# EAGLE schematic FDNverbV1_1 (EAGLE 7.6.0)
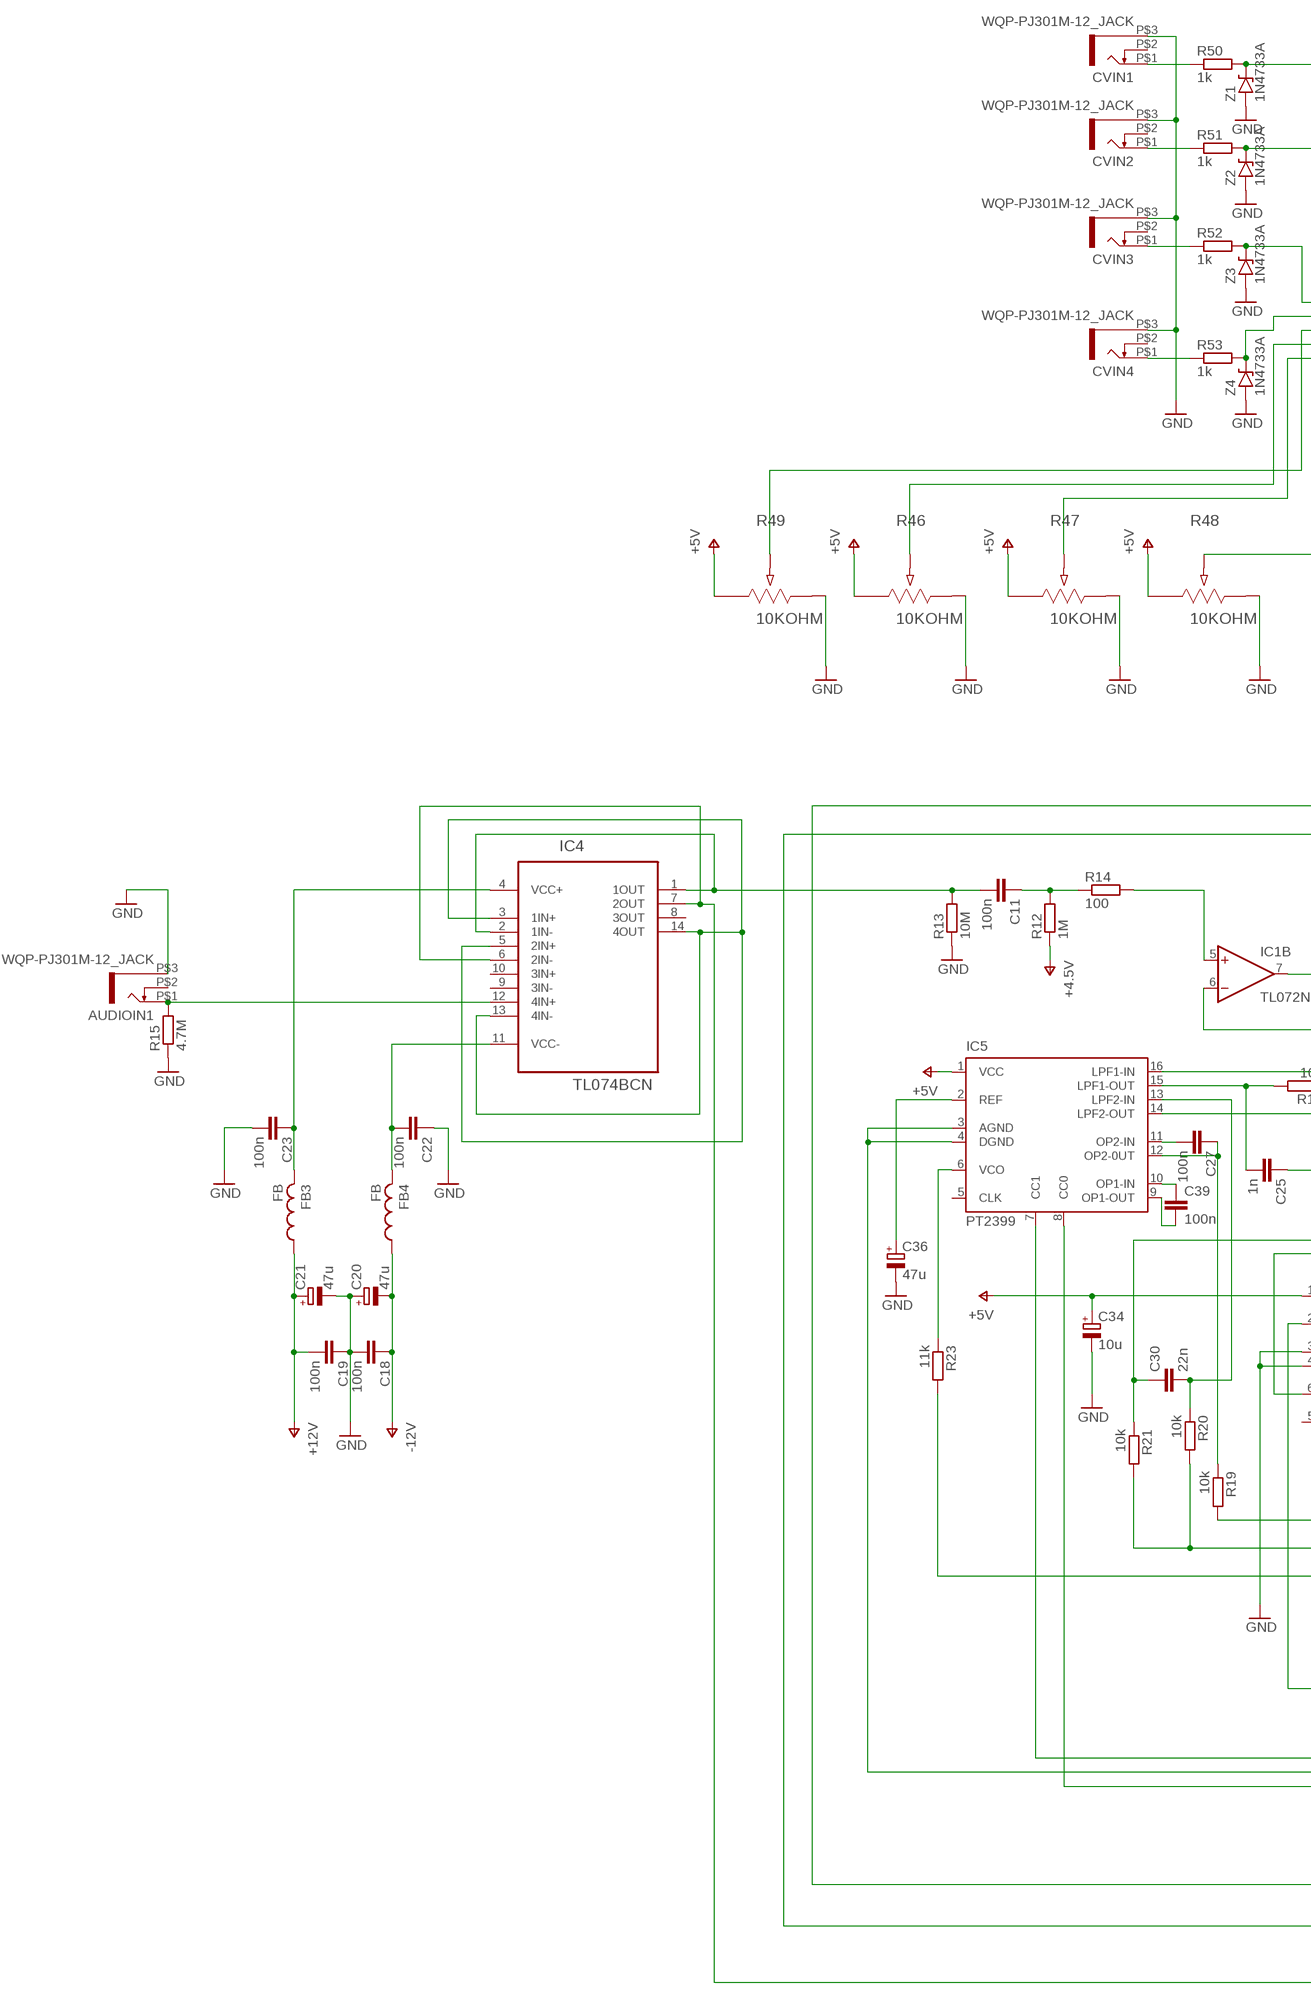
[diagram p0: schematic, sheet 1, part 1 of 3]
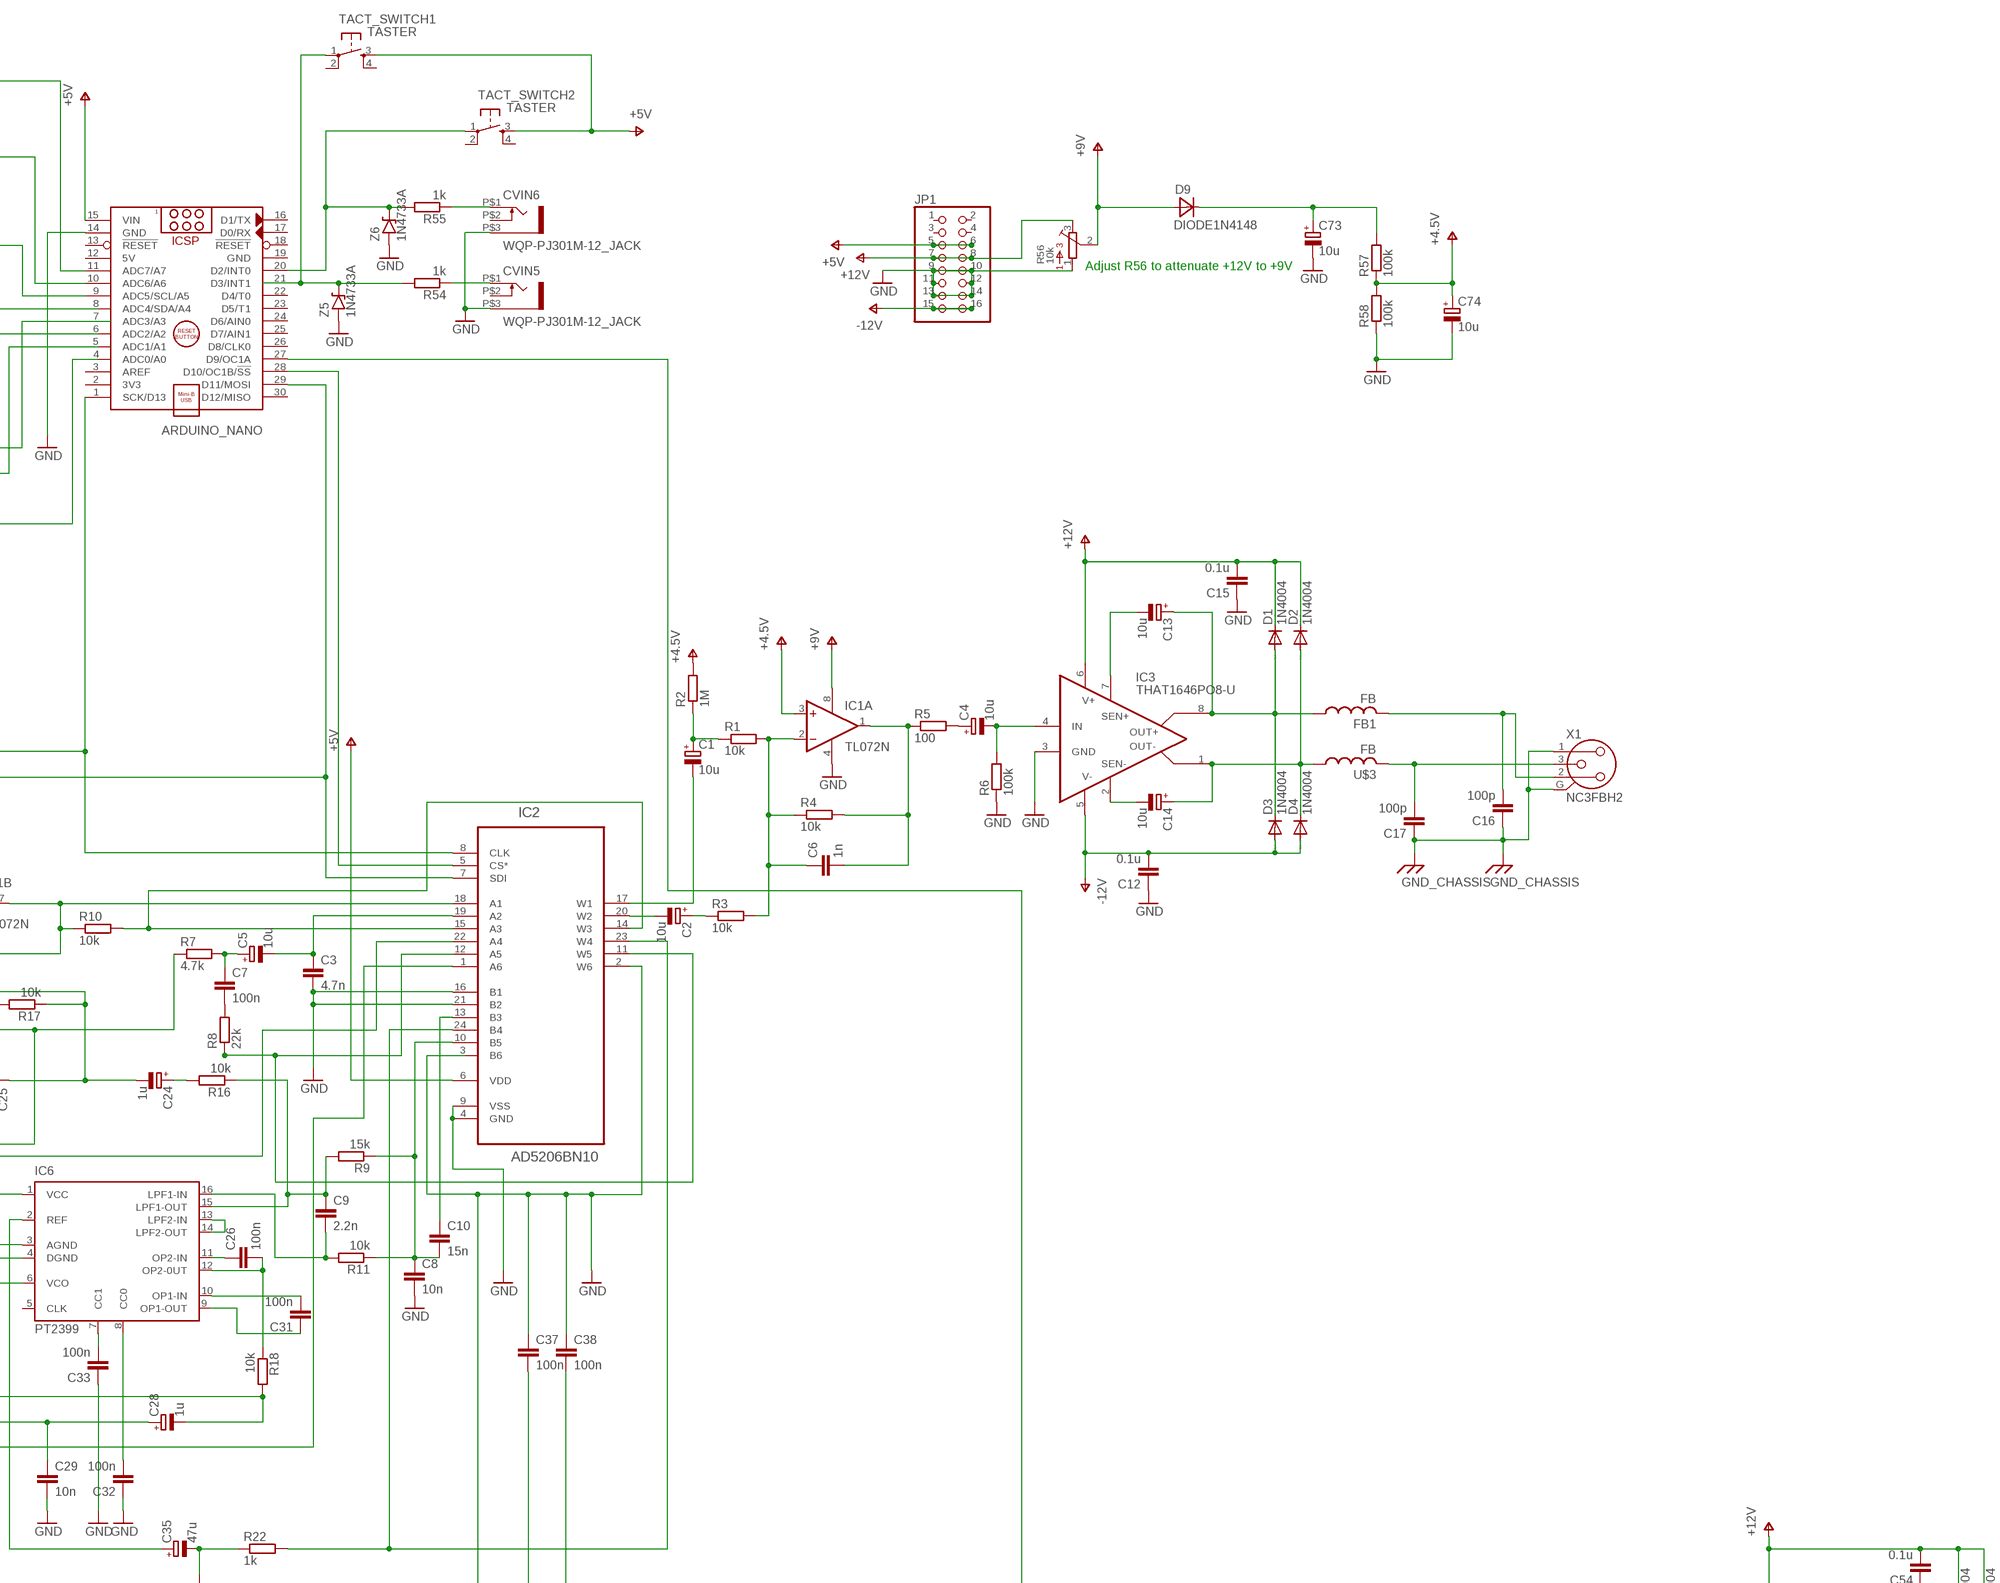
[diagram p1: schematic, sheet 1, part 2 of 3]
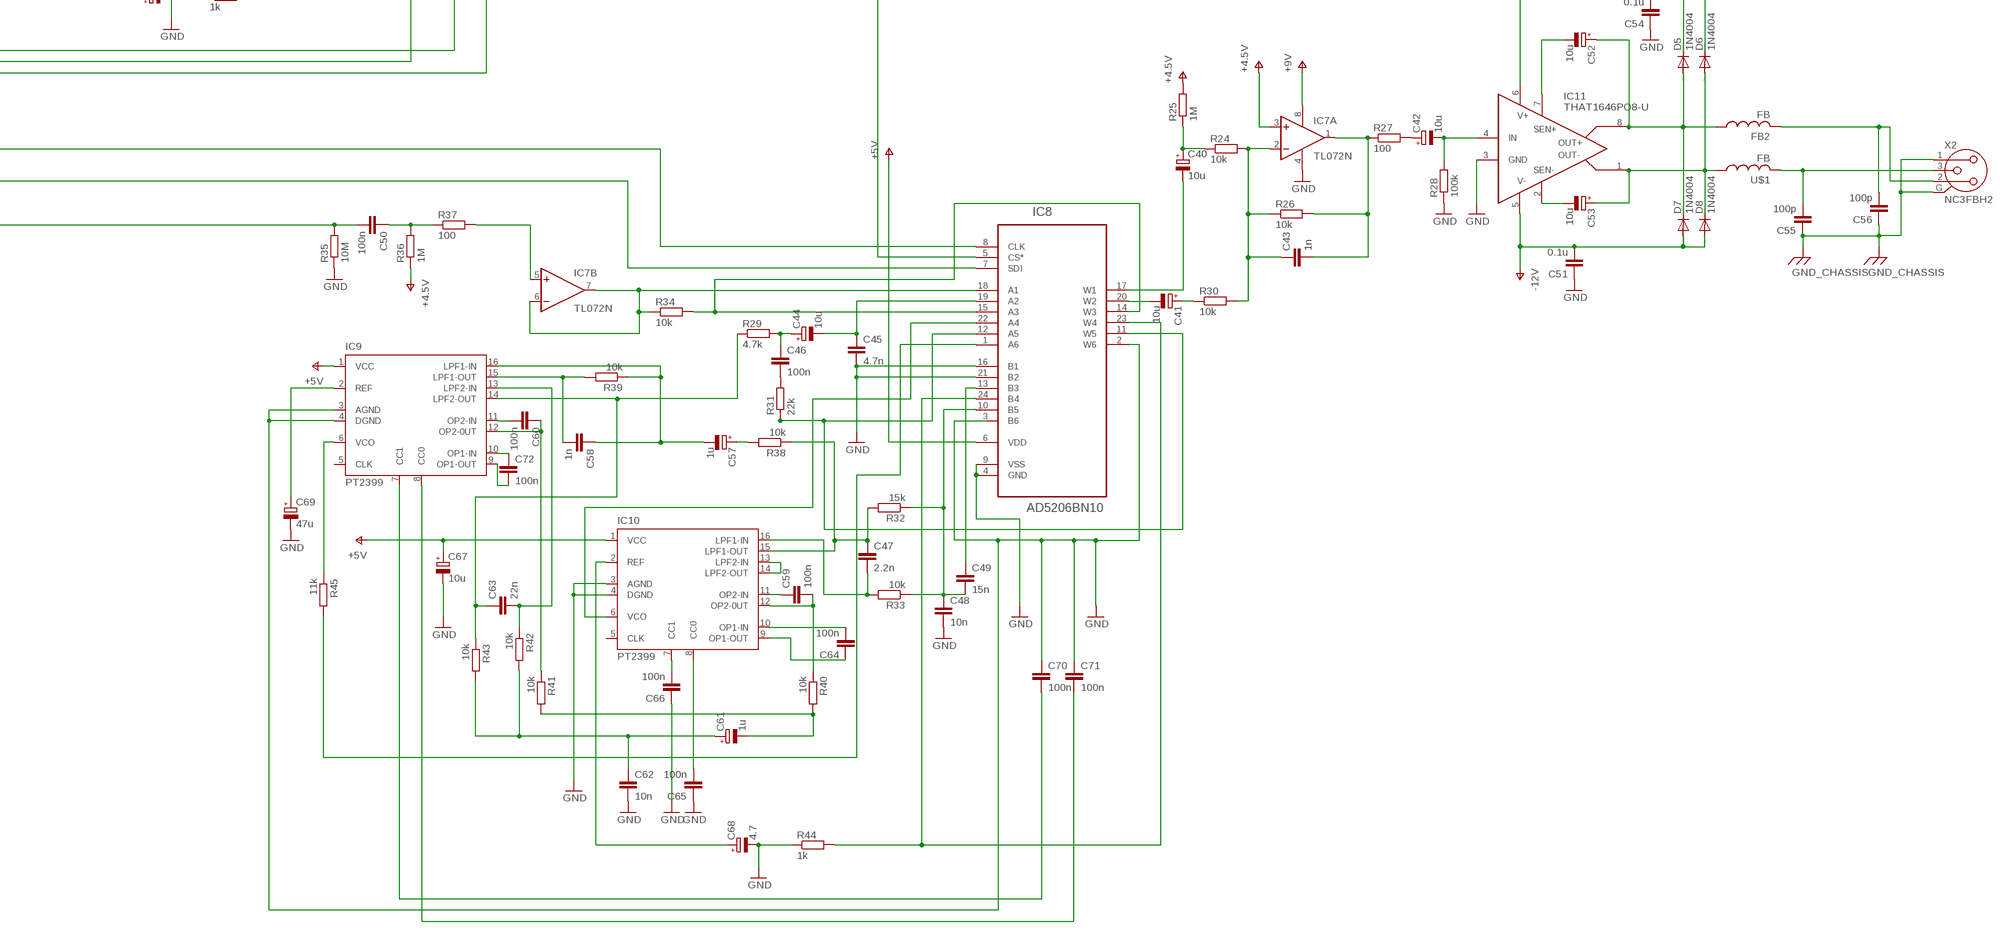
[diagram p2: schematic, sheet 1, part 3 of 3]

## Parts
ARDUINO_NANO  ARDUINO_NANO  [ARDUINO_NANO]
AUDIOIN1  WQP-PJ301M-12_JACK  [WQP-PJ301M-12_JACK]
C1  10u  CPOL3  [E5-5]
C2  10u  CPOL3  [E5-5]
C3  4.7n  C-EUC1206  [C1206]
C4  10u  CPOL3  [E5-5]
C5  10u  CPOL3  [E5-5]
C6  1n  C-EUC1206  [C1206]
C7  100n  C-EUC1206  [C1206]
C8  10n  C-EUC1206  [C1206]
C9  2.2n  C-EUC1206  [C1206]
C10  15n  C-EUC1206  [C1206]
C11  100n  C-EUC1206  [C1206]
C12  0.1u  C-EUC1206  [C1206]
C13  10u  CPOL3  [E5-5]
C14  10u  CPOL3  [E5-5]
C15  0.1u  C-EUC1206  [C1206]
C16  100p  C-EUC1206  [C1206]
C17  100p  C-EUC1206  [C1206]
C18  100n  C-EUC1206  [C1206]
C19  100n  C-EUC1206  [C1206]
C20  47u  CPOL3  [E5-5]
C21  47u  CPOL3  [E5-5]
C22  100n  C-EUC1206  [C1206]
C23  100n  C-EUC1206  [C1206]
C24  1u  CPOL3  [E5-5]
C25  1n  C-EUC1206  [C1206]
C26  100n  C-EUC1206  [C1206]
C27  100n  C-EUC1206  [C1206]
C28  1u  CPOL3  [E5-5]
C29  10n  C-EUC1206  [C1206]
C30  22n  C-EUC1206  [C1206]
C31  100n  C-EUC1206  [C1206]
C32  100n  C-EUC1206  [C1206]
C33  100n  C-EUC1206  [C1206]
C34  10u  CPOL3  [E5-5]
C35  47u  CPOL3  [E5-5]
C36  47u  CPOL3  [E5-5]
C37  100n  C-EUC1206  [C1206]
C38  100n  C-EUC1206  [C1206]
C39  100n  C-EUC1206  [C1206]
C40  10u  CPOL3  [E5-5]
C41  10u  CPOL3  [E5-5]
C42  10u  CPOL3  [E5-5]
C43  1n  C-EUC1206  [C1206]
C44  10u  CPOL3  [E5-5]
C45  4.7n  C-EUC1206  [C1206]
C46  100n  C-EUC1206  [C1206]
C47  2.2n  C-EUC1206  [C1206]
C48  10n  C-EUC1206  [C1206]
C49  15n  C-EUC1206  [C1206]
C50  100n  C-EUC1206  [C1206]
C51  0.1u  C-EUC1206  [C1206]
C52  10u  CPOL3  [E5-5]
C53  10u  CPOL3  [E5-5]
C54  0.1u  C-EUC1206  [C1206]
C55  100p  C-EUC1206  [C1206]
C56  100p  C-EUC1206  [C1206]
C57  1u  CPOL3  [E5-5]
C58  1n  C-EUC1206  [C1206]
C59  100n  C-EUC1206  [C1206]
C60  100n  C-EUC1206  [C1206]
C61  1u  CPOL3  [E5-5]
C62  10n  C-EUC1206  [C1206]
C63  22n  C-EUC1206  [C1206]
C64  100n  C-EUC1206  [C1206]
C65  100n  C-EUC1206  [C1206]
C66  100n  C-EUC1206  [C1206]
C67  10u  CPOL3  [E5-5]
C68  4.7  CPOL3  [E5-5]
C69  47u  CPOL3  [E5-5]
C70  100n  C-EUC1206  [C1206]
C71  100n  C-EUC1206  [C1206]
C72  100n  C-EUC1206  [C1206]
C73  10u  CPOL3  [E5-5]
C74  10u  CPOL3  [E5-5]
CVIN1  WQP-PJ301M-12_JACK  [WQP-PJ301M-12_JACK]
CVIN2  WQP-PJ301M-12_JACK  [WQP-PJ301M-12_JACK]
CVIN3  WQP-PJ301M-12_JACK  [WQP-PJ301M-12_JACK]
CVIN4  WQP-PJ301M-12_JACK  [WQP-PJ301M-12_JACK]
CVIN5  WQP-PJ301M-12_JACK  [WQP-PJ301M-12_JACK]
CVIN6  WQP-PJ301M-12_JACK  [WQP-PJ301M-12_JACK]
D1  1N4004  [DO41-10]
D2  1N4004  [DO41-10]
D3  1N4004  [DO41-10]
D4  1N4004  [DO41-10]
D5  1N4004  [DO41-10]
D6  1N4004  [DO41-10]
D7  1N4004  [DO41-10]
D8  1N4004  [DO41-10]
D9  DIODE1N4148  [DO-35]
FB1  FB  [FB]
FB2  FB  [FB]
FB3  FB  [FB]
FB4  FB  [FB]
IC1  TL072N  [DIL8]
IC2  AD5206BN10  [DIP254P762X508-24P]
IC3  THAT1646PO8-U  [DIL08]
IC4  TL074BCN  [DIP254P762X508-14]
IC5  PT2399  [DIP16]
IC6  PT2399  [DIP16]
IC7  TL072N  [DIL8]
IC8  AD5206BN10  [DIP254P762X508-24P]
IC9  PT2399  [DIP16]
IC10  PT2399  [DIP16]
IC11  THAT1646PO8-U  [DIL08]
JP1  PINHD-2X8-BIG  [2X8]
R1  10k  R-EU_M1206  [M1206]
R2  1M  R-EU_M1206  [M1206]
R3  10k  R-EU_M1206  [M1206]
R4  10k  R-EU_M1206  [M1206]
R5  100  R-EU_M1206  [M1206]
R6  100k  R-EU_M1206  [M1206]
R7  4.7k  R-EU_M1206  [M1206]
R8  22k  R-EU_M1206  [M1206]
R9  15k  R-EU_M1206  [M1206]
R10  10k  R-EU_M1206  [M1206]
R11  10k  R-EU_M1206  [M1206]
R12  1M  R-EU_M1206  [M1206]
R13  10M  R-EU_M1206  [M1206]
R14  100  R-EU_M1206  [M1206]
R15  4.7M  R-EU_M1206  [M1206]
R16  10k  R-EU_M1206  [M1206]
R17  10k  R-EU_M1206  [M1206]
R18  10k  R-EU_M1206  [M1206]
R19  10k  R-EU_M1206  [M1206]
R20  10k  R-EU_M1206  [M1206]
R21  10k  R-EU_M1206  [M1206]
R22  1k  R-EU_M1206  [M1206]
R23  11k  R-EU_M1206  [M1206]
R24  10k  R-EU_M1206  [M1206]
R25  1M  R-EU_M1206  [M1206]
R26  10k  R-EU_M1206  [M1206]
R27  100  R-EU_M1206  [M1206]
R28  100k  R-EU_M1206  [M1206]
R29  4.7k  R-EU_M1206  [M1206]
R30  10k  R-EU_M1206  [M1206]
R31  22k  R-EU_M1206  [M1206]
R32  15k  R-EU_M1206  [M1206]
R33  10k  R-EU_M1206  [M1206]
R34  10k  R-EU_M1206  [M1206]
R35  10M  R-EU_M1206  [M1206]
R36  1M  R-EU_M1206  [M1206]
R37  100  R-EU_M1206  [M1206]
R38  10k  R-EU_M1206  [M1206]
R39  10k  R-EU_M1206  [M1206]
R40  10k  R-EU_M1206  [M1206]
R41  10k  R-EU_M1206  [M1206]
R42  10k  R-EU_M1206  [M1206]
R43  10k  R-EU_M1206  [M1206]
R44  1k  R-EU_M1206  [M1206]
R45  11k  R-EU_M1206  [M1206]
R46  10KOHM  EVUF2LFL3B14-F2L_F3L  [POT-EVUF2L]
R47  10KOHM  EVUF2LFL3B14-F2L_F3L  [POT-EVUF2L]
R48  10KOHM  EVUF2LFL3B14-F2L_F3L  [POT-EVUF2L]
R49  10KOHM  EVUF2LFL3B14-F2L_F3L  [POT-EVUF2L]
R50  1k  R-EU_M1206  [M1206]
R51  1k  R-EU_M1206  [M1206]
R52  1k  R-EU_M1206  [M1206]
R53  1k  R-EU_M1206  [M1206]
R54  1k  R-EU_M1206  [M1206]
R55  1k  R-EU_M1206  [M1206]
R56  10k  3362H  [3362H]
R57  100k  R-EU_M1206  [M1206]
R58  100k  R-EU_M1206  [M1206]
TACT_SWITCH1  TASTER  [TASTER]
TACT_SWITCH2  TASTER  [TASTER]
U$1  FB  [FB]
U$3  FB  [FB]
X1  NC3FBH2  [NC3FBH2]
X2  NC3FBH2  [NC3FBH2]
Z1  1N4733A  1N47XX2  [DO41-2]
Z2  1N4733A  1N47XX2  [DO41-2]
Z3  1N4733A  1N47XX2  [DO41-2]
Z4  1N4733A  1N47XX2  [DO41-2]
Z5  1N4733A  1N47XX2  [DO41-2]
Z6  1N4733A  1N47XX2  [DO41-2]

## Nets
GND: ARDUINO_NANO.14(GND) AUDIOIN1.P$3 C3.2 C8.2 C12.1 C15.1 C16.1 C17.1 C18.2 C19.1 C20.+ C21.- C22.1 C23.2 C29.2 C32.1 C33.1 C34.- C35.- C36.- C37.1 C38.1 C45.2 C48.2 C51.1 C54.1 C55.1 C55.2 C56.1 C62.2 C65.1 C66.1 C67.- C68.- C69.- C70.1 C71.1 C73.- C74.- CVIN1.P$3 CVIN2.P$3 CVIN3.P$3 CVIN4.P$3 CVIN5.P$3 CVIN6.P$3 IC1.4(A:V-) IC2.2(W6) IC2.4(GND) IC2.9(VSS) IC2.16(B1) IC3.3(GND) IC5.3(AGND) IC5.4(DGND) IC6.3(AGND) IC6.4(DGND) IC7.4(A:V-) IC8.2(W6) IC8.4(GND) IC8.9(VSS) IC8.16(B1) IC8.21(B2) IC9.3(AGND) IC9.4(DGND) IC10.3(AGND) IC10.4(DGND) IC11.3(GND) JP1.9 JP1.10 JP1.11 JP1.12 JP1.13 JP1.14 R6.1 R13.1 R15.1 R22.1 R28.1 R35.1 R44.1 R46.3 R47.3 R48.3 R49.3 R56.1 R58.1 U$1.P$2 X1.1 X1.G X2.1 X2.G Z1.A Z2.A Z3.A Z4.A Z5.A Z6.A ; supply symbol labelled GND_CHASSIS
N$1: C6.1 IC1.2(A:-IN) R1.2 R3.2 R4.1
N$2: C1.+ R1.1 R2.1
N$3: C1.- IC2.17(W1)
N$4: IC1.6(B:-IN) IC1.7(B:OUT) IC2.18(A1) R10.1
N$5: C6.2 IC1.1(A:OUT) R4.2 R5.1
N$6: C4.+ R5.2
N$7: C2.- IC2.20(W2)
N$8: C2.+ R3.1
N$9: C4.- IC3.4(IN) R6.2
N$10: C3.1 C5.- IC2.19(A2)
N$11: C5.+ C7.1 R7.2
N$12: C31.2 IC6.10(OP1-IN)
N$13: R48.2
N$14: ARDUINO_NANO.1(SCK/D13) IC2.8(CLK) IC8.8(CLK)
N$15: ARDUINO_NANO.28(D10/OC1B/!SS) IC2.5(CS*)
N$16: IC2.11(W5) IC2.12(A5) R8.1
N$17: C7.2 R8.2
N$18: C9.1 IC6.15(LPF1-OUT) R9.2 R16.1
N$19: C8.1 C10.2 IC2.10(B5) R9.1 R11.1
N$20: C9.2 IC6.16(LPF1-IN) R11.2
N$21: IC2.14(W3) IC2.15(A3) R10.2
N$22: C10.1 IC2.13(B3)
N$23: C24.- C25.1 IC5.16(LPF1-IN) R17.1
N$24: C11.2 IC4.1(1OUT) IC4.2(1IN-) R13.2
N$25: C11.1 R12.2 R14.1
N$26: IC1.5(B:+IN) R14.2
N$27: C13.- IC3.7(SEN+)
N$28: C13.+ D1.A D3.C FB1.P$1 IC3.8(OUT+)
N$29: C14.- IC3.2(SEN-)
N$30: C14.+ D2.A D4.C IC3.1(OUT-) U$3.P$1
N$31: C17.2 U$3.P$2 X1.3
N$32: C16.2 FB1.P$2 X1.2
N$33: AUDIOIN1.P$1 IC4.12(4IN+) R15.2
N$34: IC4.3(1IN+) IC4.5(2IN+) IC4.13(4IN-) IC4.14(4OUT)
N$35: C22.2 FB4.P$2 IC4.11(VCC-)
N$36: C23.1 FB3.P$2 IC4.4(VCC+)
N$37: C50.2 IC4.6(2IN-) IC4.7(2OUT) R35.2
N$38: IC6.13(LPF2-IN) IC6.14(LPF2-OUT)
N$39: C24.+ R16.2
N$40: C25.2 IC5.15(LPF1-OUT) R17.2
N$41: C26.1 IC6.11(OP2-IN)
N$42: C26.2 IC6.12(OP2-0UT) R18.1
N$43: C28.- R18.2 R19.2
N$44: C27.1 IC5.12(OP2-0UT) R19.1
N$45: C27.2 IC5.11(OP2-IN)
N$46: C30.1 IC5.14(LPF2-OUT) R7.1 R21.1
N$47: C28.+ C29.1 R20.2 R21.2
N$48: C30.2 IC5.13(LPF2-IN) R20.1
N$49: C31.1 IC6.9(OP1-OUT)
N$50: C35.+ IC6.2(REF)
N$51: C32.2 IC6.8(CC0)
N$52: C33.2 IC6.7(CC1)
N$53: C37.2 IC5.7(CC1)
N$54: IC2.23(W4) IC2.24(B4) R22.2
N$55: IC2.22(A4) IC6.6(VCO)
N$56: C36.+ IC5.2(REF)
N$57: IC5.6(VCO) R23.1
N$58: IC2.1(A6) R23.2
N$59: C38.2 IC5.8(CC0)
N$60: C39.1 IC5.10(OP1-IN)
N$61: C39.2 IC5.9(OP1-OUT)
N$62: C43.1 IC7.2(A:-IN) R24.2 R26.1 R30.2
N$63: C40.+ R24.1 R25.1
N$64: C43.2 IC7.1(A:OUT) R26.2 R27.1
N$65: C42.+ R27.2
N$66: C42.- IC11.4(IN) R28.2
N$67: C40.- IC8.17(W1)
N$68: IC7.6(B:-IN) IC7.7(B:OUT) IC8.18(A1) R34.1
N$69: C41.- IC8.20(W2)
N$70: C44.- C45.1 IC8.19(A2)
N$71: C44.+ C46.1 R29.2
N$72: ARDUINO_NANO.29(D11/MOSI) IC2.7(SDI) IC8.7(SDI)
N$73: R47.2
N$74: ARDUINO_NANO.27(D9/OC1A) IC8.5(CS*)
N$75: C41.+ R30.1
N$76: IC8.11(W5) IC8.12(A5) R31.1
N$77: C46.2 R31.2
N$78: C48.1 C49.2 IC8.10(B5) R32.1 R33.1
N$79: C47.2 IC10.16(LPF1-IN) R33.2
N$80: C47.1 IC10.15(LPF1-OUT) R32.2 R38.1
N$81: IC8.14(W3) IC8.15(A3) R34.2
N$82: C49.1 IC8.13(B3)
N$83: R46.2
N$84: C50.1 R36.2 R37.1
N$85: IC7.5(B:+IN) R37.2
N$86: C52.- IC11.7(SEN+)
N$87: C52.+ D5.A D7.C FB2.P$1 IC11.8(OUT+)
N$88: C53.- IC11.2(SEN-)
N$89: C53.+ D6.A D8.C IC11.1(OUT-) U$1.P$1
N$91: C56.2 FB2.P$2 X2.2
N$92: IC10.13(LPF2-IN) IC10.14(LPF2-OUT)
N$93: C57.+ R38.2
N$94: C57.- C58.1 IC9.16(LPF1-IN) R39.1
N$95: C58.2 IC9.15(LPF1-OUT) R39.2
N$96: C59.1 IC10.11(OP2-IN)
N$97: C59.2 IC10.12(OP2-0UT) R40.1
N$98: C61.- R40.2 R41.2
N$99: C60.1 IC9.12(OP2-0UT) R41.1
N$100: C60.2 IC9.11(OP2-IN)
N$101: C61.+ C62.1 R42.2 R43.2
N$102: C63.1 IC9.14(LPF2-OUT) R29.1 R43.1
N$103: C63.2 IC9.13(LPF2-IN) R42.1
N$104: C64.2 IC10.10(OP1-IN)
N$105: C64.1 IC10.9(OP1-OUT)
N$106: C65.2 IC10.8(CC0)
N$107: C66.2 IC10.7(CC1)
N$108: C68.+ IC10.2(REF)
N$109: IC8.23(W4) IC8.24(B4) R44.2
N$110: IC8.22(A4) IC10.6(VCO)
N$111: C69.+ IC9.2(REF)
N$112: IC9.6(VCO) R45.1
N$113: IC8.1(A6) R45.2
N$114: C70.2 IC9.7(CC1)
N$115: C71.2 IC9.8(CC0)
N$116: C72.1 IC9.10(OP1-IN)
N$117: C72.2 IC9.9(OP1-OUT)
N$118: R49.2
N$119: CVIN4.P$1 R53.1
N$120: CVIN3.P$1 R52.1
N$121: CVIN2.P$1 R51.1
N$122: CVIN1.P$1 R50.1
N$123: ARDUINO_NANO.11(ADC7/A7) R50.2 Z1.C
N$124: ARDUINO_NANO.10(ADC6/A6) R51.2 Z2.C
N$125: ARDUINO_NANO.9(ADC5/SCL/A5) R52.2 Z3.C
N$126: R53.2 Z4.C
N$127: CVIN6.P$1 R55.1
N$128: CVIN5.P$1 R54.1
N$129: R54.2 TACT_SWITCH1.1(P) Z5.C
N$130: ARDUINO_NANO.20(D2/INT0) R55.2 TACT_SWITCH2.1(P) Z6.C
N$131: C73.+ D9.- R57.2
V+: ARDUINO_NANO.15(VIN) C12.2 C15.2 C18.1 C19.2 C20.- C21.+ C34.+ C51.2 C54.2 C67.+ C74.+ D1.C D2.C D3.A D4.A D5.C D6.C D7.A D8.A D9.+ FB3.P$1 FB4.P$1 IC1.3(A:+IN) IC1.8(A:V+) IC2.6(VDD) IC3.5(V-) IC3.6(V+) IC5.1(VCC) IC6.1(VCC) IC7.3(A:+IN) IC7.8(A:V+) IC8.6(VDD) IC9.1(VCC) IC10.1(VCC) IC11.5(V-) IC11.6(V+) JP1.5 JP1.6 JP1.7 JP1.8 JP1.15 JP1.16 R2.2 R12.1 R25.2 R36.1 R46.1 R47.1 R48.1 R49.1 R56.2 R56.3 R57.1 R58.2 TACT_SWITCH1.3(S) TACT_SWITCH2.3(S) ; supply symbol labelled +9V, +4.5V, +12V, -12V, +5V
Unconnected: ARDUINO_NANO.2(3V3) ARDUINO_NANO.3(AREF) ARDUINO_NANO.4(ADC0/A0) ARDUINO_NANO.5(ADC1/A1) ARDUINO_NANO.6(ADC2/A2) ARDUINO_NANO.7(ADC3/A3) ARDUINO_NANO.8(ADC4/SDA/A4) ARDUINO_NANO.13(!RESET) ARDUINO_NANO.16(D1/TX) ARDUINO_NANO.17(D0/RX) ARDUINO_NANO.18(!RESET) ARDUINO_NANO.21(D3/INT1) ARDUINO_NANO.22(D4/T0) ARDUINO_NANO.23(D5/T1) ARDUINO_NANO.24(D6/AIN0) ARDUINO_NANO.25(D7/AIN1) ARDUINO_NANO.26(D8/CLK0) ARDUINO_NANO.30(D12/MISO) AUDIOIN1.P$2 CVIN1.P$2 CVIN2.P$2 CVIN3.P$2 CVIN4.P$2 CVIN5.P$2 CVIN6.P$2 IC2.3(B6) IC2.21(B2) IC4.8(3OUT) IC4.9(3IN-) IC4.10(3IN+) IC5.5(CLK) IC6.5(CLK) IC8.3(B6) IC9.5(CLK) IC10.5(CLK) JP1.1 JP1.2 JP1.3 JP1.4 TACT_SWITCH1.2(P1) TACT_SWITCH1.4(S1) TACT_SWITCH2.2(P1) TACT_SWITCH2.4(S1) X2.3

## Notes on the sheet
- Adjust R56 to attenuate +12V to +9V

## Power pins joined to a net without a drawn wire
5V: ARDUINO_NANO.12(5V)
GND: ARDUINO_NANO.19(GND)

## Library data of the parts
ARDUINO_NANO = ArduinoNanoV30:ARDUINO_NANO: Arduino Nano V3.0 Module Overview: The Arduino Nano is a small, complete, and breadboard-friendly board based on the ATmega328 (Arduino Nano 3.x) or ATmega168 (Arduino Nano 2.x). It has more or less the same functionality of the Arduino Duemilanove, but in a different package. It lacks only a DC power jack, and works with a Mini-B USB cable instead of a standard one. The Nano was designed and is being produced by Gravitech <http://www.gravitech.us/arna30wiatp.html>. General specifications: Item Value Microcontroller Atmel ATmega168 or ATmega328 Operating Voltage (logic level) 5 V Input Voltage (recommended) 7-12 V Input Voltage (limits) 6-20 V Digital I/O Pins 14 (of which 6 provide PWM output) Analog Input Pins 8 DC Current per I/O Pin 40 mA Flash Memory 16 KB (ATmega168) or 32 KB (ATmega328) of which 2 KB used by bootloader SRAM 1 KB (ATmega168) or 2 KB (ATmega328) EEPROM 512 bytes (ATmega168) or 1 KB (ATmega328) Clock Speed 16 MHz Dimensions 0.73" x 1.70" Length 45 mm Width 18 mm Weigth 5 g Power: The Arduino Nano can be powered via the Mini-B USB connection, 6-20V unregulated external power supply (pin 30), or 5V regulated external power supply (pin 27). The power source is automatically selected to the highest voltage source. Memory: The ATmega168 has 16 KB of flash memory for storing code (of which 2 KB is used for the bootloader); the ATmega328 has 32 KB, (also with 2 KB used for the bootloader). The ATmega168 has 1 KB of SRAM and 512 bytes of EEPROM (which can be read and written with the EEPROM library); the ATmega328 has 2 KB of SRAM and 1 KB of EEPROM. Input and Output: Each of the 14 digital pins on the Nano can be used as an input or output, using pinMode(), digitalWrite(), and digitalRead() functions. They operate at 5 volts. Each pin can provide or receive a maximum of 40 mA and has an internal pull-up resistor (disconnected by default) of 20-50 kOhms. In addition, some pins have specialized functions. Visit Arduino - ArduinoBoardNano <https://www.arduino.cc/en/Main/ArduinoBoardNano>
AUDIOIN1 CVIN1-CVIN6 = thonkiconn:WQP-PJ301M-12_JACK
C1 C2 C4 C5 C13 C14 C20 C21 C24 C28 C34-C36 C40-C42 C44 C52 C53 C57 C61 C67-C69 C73 C74 = ee2parts:CPOL: Electrolytic (polarised) capacitor
C3 C6-C12 C15-C19 C22 C23 C25-C27 C29-C33 C37-C39 C43 C45-C51 C54-C56 C58-C60 C62-C66 C70-C72 = resistor:C-EU: CAPACITOR, European symbol
D1-D8 = diode:1N4004: DIODE general purpose rectifier, 1 A
D9 = Diodes:DIODE: Diode; SPICE: D{NAME} {+.NET} {-.NET} 1N4148; SPICEMOD: .model 1N4148 D (IS=0.1PA, RS=16 CJO=2PF TT=12N BV=100 IBV=1nA)
FB1-FB4 U$1 U$3 = adafruit:FB: Ferrite bead Digikey #P9821BK-ND
IC1 IC7 = ee2parts:TL072
IC2 IC8 = AD5206BN10:AD5206BN10: DIGITAL POTENTIOMETER (POTS) IC PDIP-24; MPN: AD5206BN10; OC_FARNELL: 2318572; OC_NEWARK: 98B7183; PACKAGE: PDIP-24; SUPPLIER: Analog Devices
IC3 IC11 = that-corp:THAT1646: Outsmarts Balanced Line Driver
IC4 = TL074BCN:TL074BCN: OPERATIONAL AMPLIFIERS; MPN: TL074BCN; OC_FARNELL: 1459706; OC_NEWARK: 60K6989; PACKAGE: DIP-14; SUPPLIER: Texas Instruments
IC5 IC6 IC9 IC10 = echounit:PT2399: Echo Processor IC
JP1 = pimoroni:PINHD-2X8: PIN HEADER
R1-R45 R50-R55 R57 R58 = resistor:R-EU_: RESISTOR, European symbol
R46-R49 = Panasonic-Trimmer_Potentiometers:EVUF: Potentiometers; MPN: EVUF2LFL3B14; OC_FARNELL: 2282480; OC_NEWARK: 52W2662; PACKAGE: TH; POWERRATING: 50mW; SUPPLIER: PANASONIC
R56 = bourns:3362: 3362 Series 1/4" Square Trimmer
TACT_SWITCH1 TACT_SWITCH2 = switch-tact:TASTER
X1 X2 = con-neutrik_ag:NC3: Neutrik Audio Connector XLR SERIES Stereo 1/4" jack Source: www.neutrik.com/; MPN: NC3FBH2; OC_FARNELL: unknown; OC_NEWARK: 27B4226
Z1-Z6 = gm-diodes:1N47XX: Zener Diode 1N4728 - 1N4764: 3.3 V - 100V, 10% (1n47xxA 5%); DO-41 glass case